# Altium schematic sheet DB.SchDoc: Distribution Board
size A4; Revision: 1.0; SheetNumber: 1; SheetTotal: 1
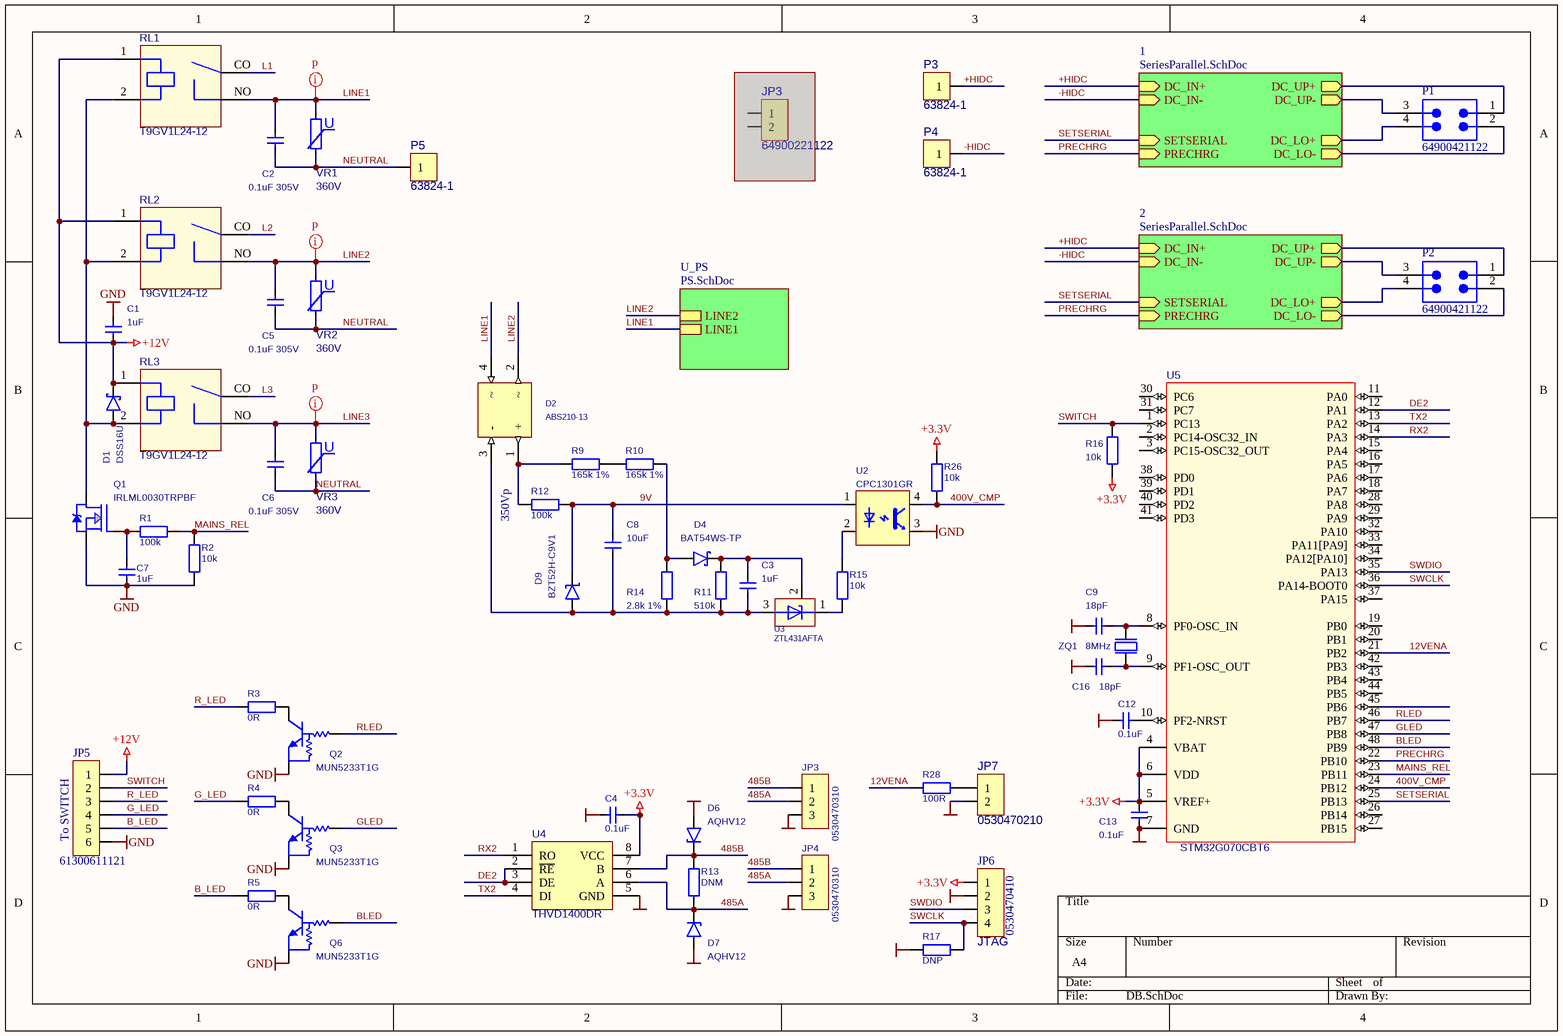
[diagram p0: DB.SchDoc]

## Parts
(Parts that share a designator on the sheet are numbered #1, #2 ... from top to bottom, then left to right.)
C1  1uF  [C-0805]
C2  0.1uF 305V  [B32921_1300x1200x600]
C3  1uF  [C-0805]
C4  0.1uF  [C-0603]
C5  0.1uF 305V  [B32921_1300x1200x600]
C6  0.1uF 305V  [B32921_1300x1200x600]
C7  1uF  [C-0603]
C8  10uF  [C-1206]
C9  18pF  [C-0603]
C12  0.1uF  [C-0603]
C13  0.1uF  [C-0603]
C16  18pF  [C-0603]
D1  DSS16U  [SOD-123]
D2  ABS210-13  [4SOPA]
D4  BAT54WS-TP  [SOD-323F]
D6  AQHV12  [SOD-523]
D7  AQHV12  [SOD-523]
D9  BZT52H-C9V1  [SOD-123]
JP3#1  64900221122  [64900221122]  (masked out: inside a compile mask, not in the netlist)
JP3#2  0530470310  [H53047-03]
JP4  0530470310  [H53047-03]
JP5  61300611121  [IDC1-6P]
JP6  0530470410  [H53047-04]
JP7  0530470210  [H53047-02]
P1  64900421122  [64900421122]
P2  64900421122  [64900421122]
P3  63824-1  [63824-1]
P4  63824-1  [63824-1]
P5  63824-1  [63824-1]
Q1  IRLML0030TRPBF  [SOT-23]
Q2  MUN5233T1G  [SOT-323]
Q3  MUN5233T1G  [SOT-323]
Q6  MUN5233T1G  [SOT-323]
R1  100k  [R-0603]
R2  10k  [R-0603]
R3  0R  [R-0603]
R4  0R  [R-0603]
R5  0R  [R-0603]
R9  165k 1%  [R-1206]
R10  165k 1%  [R-1206]
R11  510k  [R-0603]
R12  100k  [R-5W_SS]
R13  DNM  [R-1206]
R14  2.8k 1%  [R-0603]
R15  10k  [R-0603]
R16  10k  [R-0603]
R17  DNP  [R-0603]
R26  10k  [R-0603]
R28  100R  [R-0603]
RL1  T9GV1L24-12  [T9GV1L14]
RL2  T9GV1L24-12  [T9GV1L14]
RL3  T9GV1L24-12  [T9GV1L14]
U2  CPC1301GR  [SOIC_1301GR_IXY]
U3  ZTL431AFTA  [SOT-23]
U4  THVD1400DR  [SO8-(SOT-96-1)]
U5  STM32G070CBT6  [LQFP48]
VR1  360V  [ERZ-E11-511]
VR2  360V  [ERZ-E11-511]
VR3  360V  [ERZ-E11-511]
ZQ1  8MHz  [XTAL_5.0x3.2_4]

## Sub-sheets
1 = SeriesParallel.SchDoc: PRECHRG (in), DC_IN+ (in), DC_IN- (in), DC_UP+ (out), DC_UP- (out), DC_LO+ (out), DC_LO- (out), SETSERIAL (in)
2 = SeriesParallel.SchDoc: PRECHRG (in), DC_IN+ (in), DC_IN- (in), DC_UP+ (out), DC_UP- (out), DC_LO+ (out), DC_LO- (out), SETSERIAL (in)
U_PS = PS.SchDoc: LINE2, LINE1

## Nets
+3.3V: C4.2 C13.2 JP6.1 R16.2 R26.1 U4.8(VCC) U5.4(VBAT) U5.5(VREF+) U5.6(VDD)
+12V: C1.1 D1.K JP5.1 RL1.1 RL2.1 RL3.1
GND: C1.2 C4.1 C7.2 C9.1 C12.1 C13.1 C16.1 D6.A D7.A JP3#2.3 JP4.3 JP5.6 JP6.2 JP7.2 Q1.2(SOURCE) Q2.2 Q3.2 Q6.2 R2.2 R17.1 U2.3 U4.5(GND) U5.7(GND)
9V: C8.1 D9.K R12.1 U2.1
12VENA: R28.2 U5.21(PB2)
400V_CMP: R26.2 U2.4 U5.24(PB12)
485A: D7.K JP3#2.2 JP4.2 R13.2 U4.6(A)
485B: D6.K JP3#2.1 JP4.1 R13.1 U4.7(B)
+HIDC: P3.1 ; sheet 1/DC_IN+, sheet 2/DC_IN+
-HIDC: P4.1 ; sheet 1/DC_IN-, sheet 2/DC_IN-
B_LED: JP5.5 R5.1
BLED: Q6.1 U5.48(PB9)
DE2: U4.2(~{RE}) U4.3(DE) U5.12(PA1)
G_LED: JP5.4 R4.1
GLED: Q3.1 U5.47(PB8)
L1: RL1.CO
L2: RL2.CO
L3: RL3.CO
LINE1: C2.1 D2.4 RL1.NO VR1.1 ; sheet U_PS/LINE1
LINE2: C5.1 D2.2 RL2.NO VR2.1 ; sheet U_PS/LINE2
LINE3: C6.1 RL3.NO VR3.1
MAINS_REL: R1.1 R2.1 U5.23(PB11)
NEUTRAL: C2.2 C5.2 C6.2 P5.1 VR1.2 VR2.2 VR3.2
PRECHRG: U5.22(PB10) ; sheet 1/PRECHRG, sheet 2/PRECHRG
R_LED: JP5.3 R3.1
RLED: Q2.1 U5.46(PB7)
RX2: U4.1(RO) U5.14(PA3)
SETSERIAL: U5.25(PB13) ; sheet 1/SETSERIAL, sheet 2/SETSERIAL
SWCLK: JP6.4 R17.2 U5.36(PA14-BOOT0)
SWDIO: JP6.3 U5.35(PA13)
SWITCH: JP5.2 R16.1 U5.1(PC13)
TX2: U4.4(DI) U5.13(PA2)
NetC3_1: C3.1 C8.2 D2.3(-) D9.A R11.2 R14.2 U3.3
NetC3_2: C3.2 D4.K R11.1 U3.2
NetC7_1: C7.1 Q1.1(GATE) R1.2
NetC9_2: C9.2 U5.8(PF0-OSC_IN) ZQ1.1
NetC12_2: C12.2 U5.10(PF2-NRST)
NetC16_2: C16.2 U5.9(PF1-OSC_OUT) ZQ1.3
NetD1_A: D1.A Q1.3(DRAIN) RL1.2 RL2.2 RL3.2
NetD2_1: D2.1(+) R9.2 R12.2
NetD4_A: D4.A R10.1 R14.1
NetJP7_1: JP7.1 R28.1
NetP1_1: P1.1 ; sheet 1/DC_UP+
NetP1_2: P1.2 ; sheet 1/DC_LO-
NetP1_3: P1.3 ; sheet 1/DC_UP-
NetP1_4: P1.4 ; sheet 1/DC_LO+
NetP2_1: P2.1 ; sheet 2/DC_UP+
NetP2_2: P2.2 ; sheet 2/DC_LO-
NetP2_3: P2.3 ; sheet 2/DC_UP-
NetP2_4: P2.4 ; sheet 2/DC_LO+
NetQ2_3: Q2.3 R3.2
NetQ3_3: Q3.3 R4.2
NetQ6_3: Q6.3 R5.2
NetR9_1: R9.1 R10.2
NetR15_1: R15.1 U3.1
NetR15_2: R15.2 U2.2

Not connected (* = marked no-connect by the designer): U5 2(PC14-OSC32_IN) 3(PC15-OSC32_OUT) 11(PA0) 15(PA4) 16(PA5) 17(PA6) 18(PA7) 19(PB0) 20(PB1) 26(PB14) 27(PB15) 28(PA8) 29(PA9) 30(PC6) 31(PC7) 32(PA10) 33(PA11[PA9]) 34(PA12[PA10]) 37(PA15) 38(PD0) 39(PD1) 40(PD2) 41(PD3) 42(PB3) 43(PB4) 44(PB5) 45(PB6)

## Layout directives
net class HV: LINE1, LINE2, LINE3

## Notes on the sheet
- (near R12) 350Vp
- (near JP5) To SWITCH
- (near JP6) JTAG
- Title
- Size:
- Date:
- A4
- Number:
- Time:
- Revision:
- Sheet
- of
- File:
- (in symbol VARISTOR) U

## Library data of the parts
C1 C3 C8 = C: X7R 16V; Manufacturer: Generic; Supplier 1: Digi-Key
C2 C5 C6 = C: CAP FILM 0.1UF 20% 630VDC RADIAL; Manufacturer Part Number: B32921C3104M000; Manufacturer: Generic; Supplier 1: Digi-Key; Supplier Part Number 1: 495-2318-ND
C4 = C: CAP CER; Manufacturer: Generic; Supplier 1: Digi-Key
C7 C12 C13 = C: X7R; Manufacturer: Generic; Supplier 1: Digi-Key
C9 C16 = C: CAP CER NP0; Manufacturer: Generic; Supplier 1: Digi-Key
D1 = DIODE SHOTKI: SCHOTTKY 60V SOD-123FL; Manufacturer: SMC Diode Solutions; Supplier Part Number 1: 1655-DSS16UCT-ND; Supplier 1: Digi-Key; WEB: *; Manufacturer Part Number: DSS16U
D2 = BRIDGE_SOPA: BRIDGE RECT 1PHASE 1KV 2A 4SOPA; Manufacturer: Diodes Incorporated; Manufacturer Part Number: ABS210-13; Supplier 1: Digi-Key; Supplier Part Number 1: ABS210-13DICT-ND
D4 = DIODE SHOTKI: DIODE SCHOTTKY 30V 200MA SOD323; Manufacturer: Micro Commercial Co; Supplier Part Number 1: BAT54WS-TPCT-ND; Supplier 1: Digi-Key; WEB: *; Manufacturer Part Number: BAT54WS-TP
D6 D7 = DIOD ZENER: TVS DIODE 12VWM 26VC SOD523; Manufacturer: Littelfuse Inc.; Manufacturer Part Number: AQHV12-01LTG; Supplier Part Number 1: AQHV12-01LTGCT-ND; Supplier 1: Digi-Key; WEB: *
D9 = DIOD ZENER: DIODE ZENER 9.1V 375MW SOD123F; Manufacturer: Nexperia USA Inc.; Manufacturer Part Number: BZT52H-C9V1,115; Supplier Part Number 1: 1727-3625-1-ND; Supplier 1: Digi-Key; WEB: *
JP3#1 = CON2: CONN HEADER VERT 2POS; Manufacturer: Würth Elektronik; WEB: *; Supplier Part Number 1: 732-1927-ND; Supplier 1: Digi-Key; Manufacturer Part Number: 64900221122
JP3#2 JP4 = CON3: CONN HEADER VERT 3POS 1.25MM; Manufacturer: Molex; WEB: *; Supplier Part Number 1: WM1732-ND; Supplier 1: Digi-Key; Manufacturer Part Number: 0530470310
JP5 = CON6: CONN HEADER VERT 6POS 2.54MM; Manufacturer: Molex; WEB: *; Supplier Part Number 1: 732-5319-ND; Supplier 1: Würth Elektronik; Manufacturer Part Number: 61300611121
JP6 = CON4: CONN HEADER VERT 4POS 1.25MM; Manufacturer: Molex; WEB: *; Supplier Part Number 1: WM1733-ND; Supplier 1: Digi-Key; Manufacturer Part Number: 0530470410
JP7 = CON2: CONN HEADER VERT 2POS 1.25MM; Manufacturer: Molex; WEB: *; Supplier Part Number 1: WM1731-ND; Supplier 1: Digi-Key; Manufacturer Part Number: 0530470210
P1 P2 = 64900429522: CONN HEADER VERT 4POS 4.2MM; Manufacturer: Wurth Elektronik; Supplier Part Number 1: 732-1928-ND; ComponentLink1Description: Website Link; ComponentLink1URL: https://www.we-online.com/redexpert/article/64900429522?ad; ComponentLink2Description: Datasheet Link; ComponentLink2URL: https://www.we-online.com/redexpert/spec/64900429522?ad; Manufacturer Part Number: 64900421122; Supplier 1: Digi-Key
P3-P5 = CON1: CONN QC TAB 0.250 SOLDER; Manufacturer: TE Connectivity; WEB: *; Supplier Part Number 1: A29938CT-ND; Supplier 1: Digi-Key; Manufacturer Part Number: 63824-1
Q1 = MOSF-N: MOSFET N-CH 30V 5.3A SOT23; Manufacturer: Infineon Technologies; WEB: *; Supplier 1: Digi-Key; Supplier Part Number 1: IRLML0030TRPBFCT-ND; Manufacturer Part Number: IRLML0030TRPBF
Q2 Q3 Q6 = NPN_PREBIAS: TRANS PREBIAS NPN 202MW SC70-3; Manufacturer: ON Semiconductor; WEB: https://www.digikey.com/product-detail/en/on-semiconductor/MUN5233T1G/MUN5233T1GOSCT-ND/2705167; Supplier 1: Digi-Key; Supplier Part Number 1: MUN5233T1GOSCT-ND; Manufacturer Part Number: MUN5233T1G
R1-R5 R9-R11 R13-R17 R26 R28 = R: Resistor; Manufacturer: Generic; Supplier 1: Digi-Key
R12 = R: RES 100K OHM 5% 5W AXIAL; Manufacturer Part Number: ROX5SSJ100K; Manufacturer: TE Connectivity; Supplier 1: Digi-Key; Supplier Part Number 1: A142848CT-ND
RL1-RL3 = T9GV1L14: RELAY GEN PURPOSE SPST 30A 12V; Manufacturer: TE Connectivity; Supplier 1: Digi-Key; Supplier Part Number 1: PB2418-ND; Manufacturer Part Number: T9GV1L24-12
U2 = PC357N: OPTOISOLTR 5KV DARLINGTON 4-SMD; Manufacturer: IXYS Integrated Circuits Division; Supplier 1: Digi-Key; Supplier Part Number 1: CPC1301GR-ND; Manufacturer Part Number: CPC1301GR
U3 = TL431AIDBZR: SHUNT ADJ 1% SOT23 2.5V 20V ±1%  SOT-23-3; Manufacturer: Diodes Incorporated; Supplier 1: Digi-Key; Supplier Part Number 1: ZTL431AFCT-ND; Manufacturer Part Number: ZTL431AFTA
U4 = ADM4852ARZ: RS485 8-SOIC TRANSCEIVER; Manufacturer: Texas Instruments; Supplier 1: Digi-Key; Supplier Part Number 1: 296-THVD1400DRCT-ND; Manufacturer Part Number: THVD1400DR
U5 = STM32G070CBT6: IC MCU 32BIT 128KB FLASH 48LQFP; Manufacturer: STMicroelectronics; Supplier 1: Digi-Key; Supplier Part Number 1: 497-STM32G070CBT6-ND; Manufacturer Part Number: STM32G070CBT6
VR1-VR3 = VARISTOR: VARISTOR 360V 6KA DISC 13MM; Manufacturer: Panasonic; Manufacturer Part Number: ERZ-E11A361; Supplier 1: Digikey; Supplier Part Number 1: P16686-ND
ZQ1 = ZQ_5.0x3.2_4: CRYSTAL 8.0000MHZ 18PF SMD; Manufacturer Part Number: FY0800018; Manufacturer: Diodes Incorporated; WEB: *; Supplier 1: Digi-Key; Supplier Part Number 1: FY0800018CT-ND